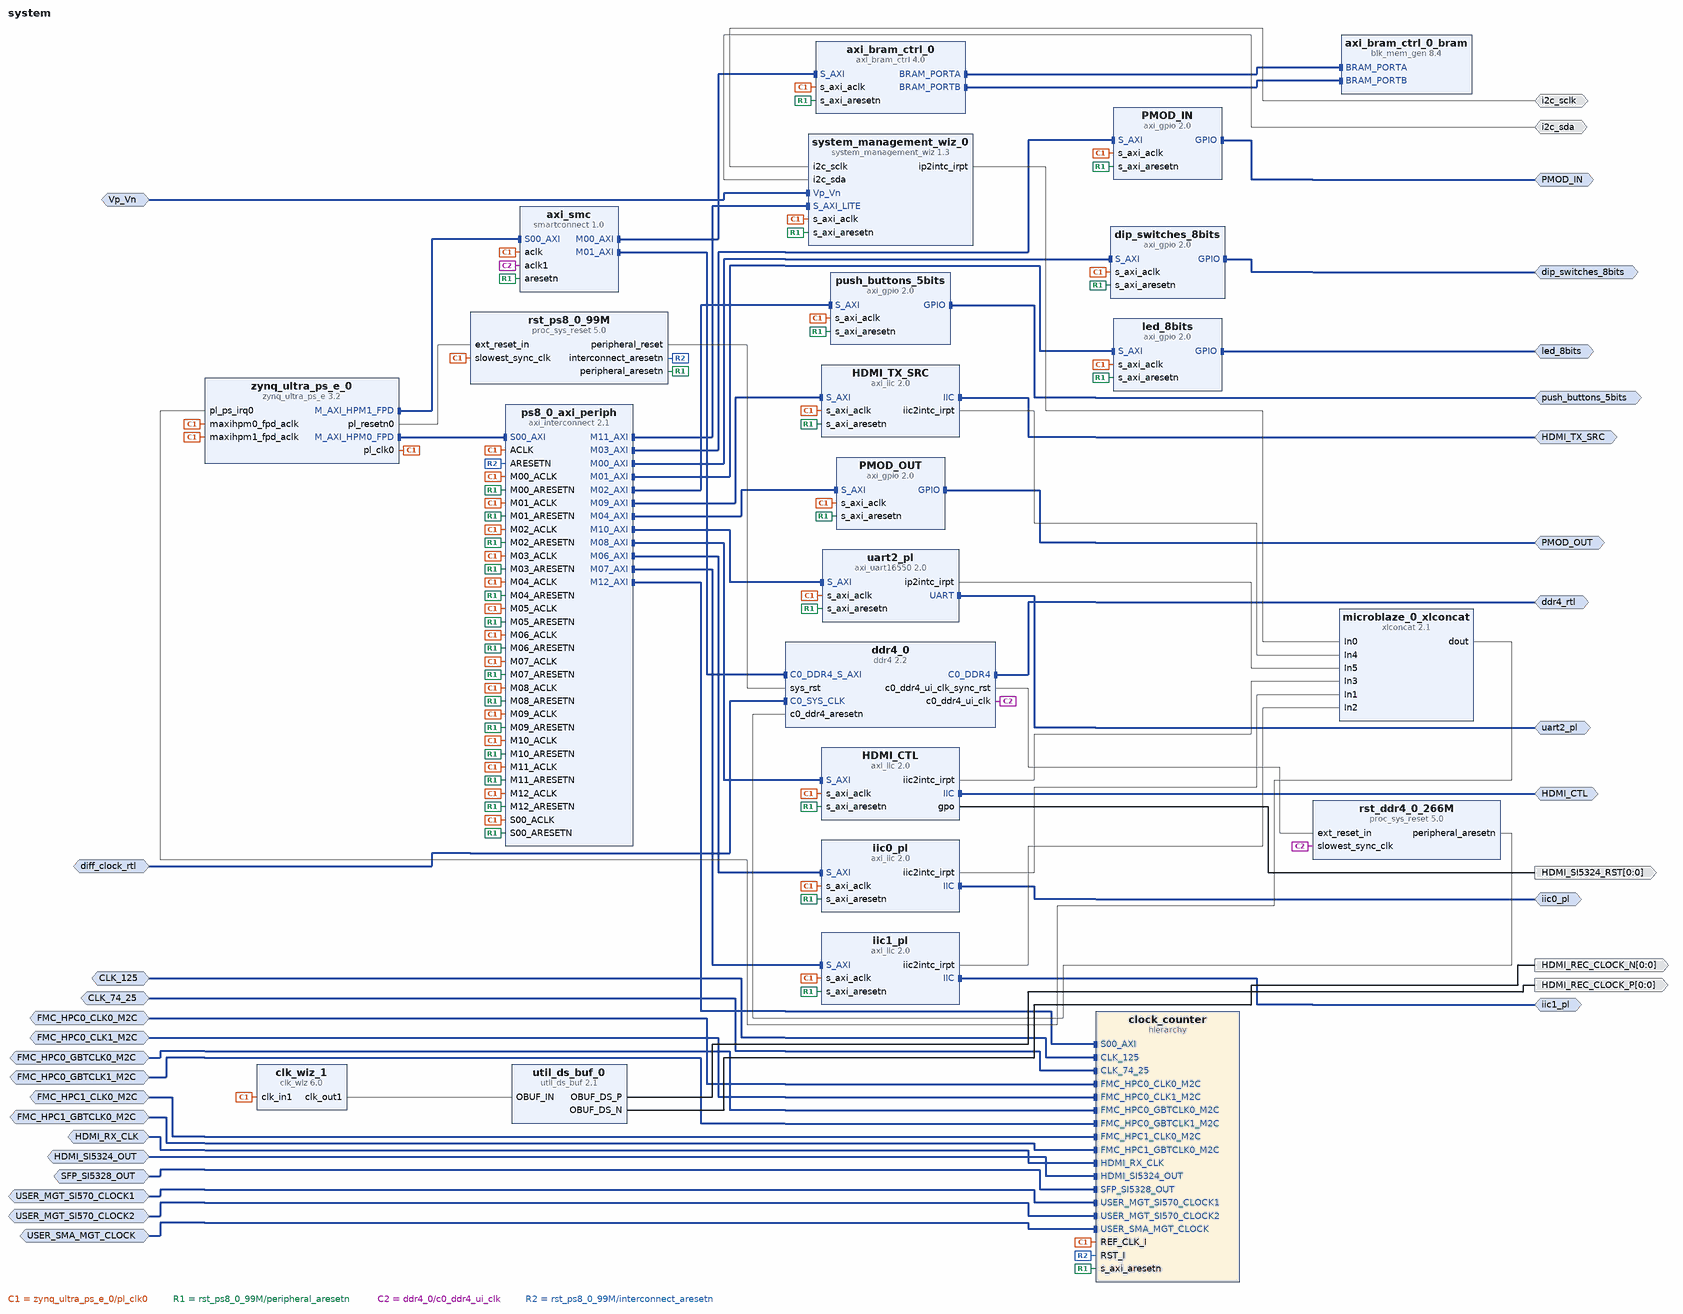
[diagram p0: block diagram of the top level]
# Vivado block design system, xczu7ev-ffvc1156-2-e, Vivado 2018.2
create_bd_design system

create_bd_intf_port -mode Master -vlnv xilinx.com:interface:iic_rtl:1.0 HDMI_CTL
create_bd_intf_port -mode Master -vlnv xilinx.com:interface:iic_rtl:1.0 HDMI_TX_SRC
create_bd_intf_port -mode Master -vlnv xilinx.com:interface:gpio_rtl:1.0 PMOD_IN
create_bd_intf_port -mode Master -vlnv xilinx.com:interface:gpio_rtl:1.0 PMOD_OUT
create_bd_intf_port -mode Slave -vlnv xilinx.com:interface:diff_analog_io_rtl:1.0 Vp_Vn
create_bd_intf_port -mode Master -vlnv xilinx.com:interface:ddr4_rtl:1.0 ddr4_rtl
create_bd_intf_port -mode Master -vlnv xilinx.com:interface:gpio_rtl:1.0 dip_switches_8bits
create_bd_intf_port -mode Master -vlnv xilinx.com:interface:iic_rtl:1.0 iic0_pl
create_bd_intf_port -mode Master -vlnv xilinx.com:interface:iic_rtl:1.0 iic1_pl
create_bd_intf_port -mode Master -vlnv xilinx.com:interface:gpio_rtl:1.0 led_8bits
create_bd_intf_port -mode Master -vlnv xilinx.com:interface:gpio_rtl:1.0 push_buttons_5bits
create_bd_intf_port -mode Master -vlnv xilinx.com:interface:uart_rtl:1.0 uart2_pl
create_bd_intf_port -mode Slave -vlnv xilinx.com:interface:diff_clock_rtl:1.0 CLK_125
create_bd_intf_port -mode Slave -vlnv xilinx.com:interface:diff_clock_rtl:1.0 CLK_74_25
create_bd_intf_port -mode Slave -vlnv xilinx.com:interface:diff_clock_rtl:1.0 FMC_HPC0_CLK0_M2C
create_bd_intf_port -mode Slave -vlnv xilinx.com:interface:diff_clock_rtl:1.0 FMC_HPC0_CLK1_M2C
create_bd_intf_port -mode Slave -vlnv xilinx.com:interface:diff_clock_rtl:1.0 FMC_HPC0_GBTCLK0_M2C
create_bd_intf_port -mode Slave -vlnv xilinx.com:interface:diff_clock_rtl:1.0 FMC_HPC0_GBTCLK1_M2C
create_bd_intf_port -mode Slave -vlnv xilinx.com:interface:diff_clock_rtl:1.0 FMC_HPC1_CLK0_M2C
create_bd_intf_port -mode Slave -vlnv xilinx.com:interface:diff_clock_rtl:1.0 FMC_HPC1_GBTCLK0_M2C
create_bd_intf_port -mode Slave -vlnv xilinx.com:interface:diff_clock_rtl:1.0 HDMI_RX_CLK
create_bd_intf_port -mode Slave -vlnv xilinx.com:interface:diff_clock_rtl:1.0 HDMI_SI5324_OUT
create_bd_intf_port -mode Slave -vlnv xilinx.com:interface:diff_clock_rtl:1.0 SFP_SI5328_OUT
create_bd_intf_port -mode Slave -vlnv xilinx.com:interface:diff_clock_rtl:1.0 USER_MGT_SI570_CLOCK1
create_bd_intf_port -mode Slave -vlnv xilinx.com:interface:diff_clock_rtl:1.0 USER_MGT_SI570_CLOCK2
create_bd_intf_port -mode Slave -vlnv xilinx.com:interface:diff_clock_rtl:1.0 USER_SMA_MGT_CLOCK
create_bd_intf_port -mode Slave -vlnv xilinx.com:interface:diff_clock_rtl:1.0 diff_clock_rtl
set_property -dict {CONFIG.FREQ_HZ 300000000} [get_bd_intf_ports diff_clock_rtl]
create_bd_port -dir IO i2c_sda
create_bd_port -dir IO i2c_sclk
create_bd_port -dir O -from 0 -to 0 HDMI_SI5324_RST
create_bd_port -dir O -from 0 -to 0 -type clk HDMI_REC_CLOCK_P
create_bd_port -dir O -from 0 -to 0 -type clk HDMI_REC_CLOCK_N

create_bd_cell -type hier clock_counter
create_bd_cell -type ip -vlnv xilinx.com:ip:blk_mem_gen:8.4 axi_bram_ctrl_0_bram
set_property -dict [list \
  CONFIG.Memory_Type True_Dual_Port_RAM \
  CONFIG.Enable_B Use_ENB_Pin \
  CONFIG.Use_RSTB_Pin true \
  CONFIG.Port_B_Clock 100 \
  CONFIG.Port_B_Write_Rate 50 \
  CONFIG.Port_B_Enable_Rate 100 \
  CONFIG.EN_SAFETY_CKT false \
] [get_bd_cells axi_bram_ctrl_0_bram]
create_bd_cell -type ip -vlnv xilinx.com:ip:xlconcat:2.1 microblaze_0_xlconcat
set_property -dict {CONFIG.NUM_PORTS 6 CONFIG.dout_width 6} [get_bd_cells microblaze_0_xlconcat]
create_bd_cell -type ip -vlnv xilinx.com:ip:axi_bram_ctrl:4.0 axi_bram_ctrl_0
set_property -dict {CONFIG.C_SELECT_XPM 0} [get_bd_cells axi_bram_ctrl_0]
create_bd_cell -type ip -vlnv xilinx.com:ip:axi_interconnect:2.1 ps8_0_axi_periph
set_property -dict {CONFIG.NUM_MI 13 CONFIG.SYNCHRONIZATION_STAGES 2} [get_bd_cells ps8_0_axi_periph]
create_bd_cell -type ip -vlnv xilinx.com:ip:system_management_wiz:1.3 system_management_wiz_0
set_property -dict [list \
  CONFIG.INTERFACE_SELECTION Enable_AXI \
  CONFIG.SERIAL_INTERFACE Enable_I2C \
  CONFIG.I2C_ADDRESS_OVERRIDE true \
  CONFIG.I2C_SLAVE_ADDRESS 32 \
  CONFIG.ENABLE_VCCPSINTLP_ALARM false \
  CONFIG.ENABLE_VCCPSAUX_ALARM false \
  CONFIG.ENABLE_VCCPSINTFP_ALARM false \
  CONFIG.ENABLE_EXTERNAL_MUX false \
  CONFIG.ENABLE_TEMP_BUS false \
  CONFIG.CHANNEL_ENABLE_VUSER0 true \
  CONFIG.CHANNEL_ENABLE_VUSER1 true \
  CONFIG.CHANNEL_ENABLE_VUSER2 true \
  CONFIG.CHANNEL_ENABLE_VUSER3 true \
  CONFIG.USER_SUPPLY0_BANK 64 \
  CONFIG.USER_SUPPLY1_BANK 65 \
  CONFIG.USER_SUPPLY2_BANK 67 \
  CONFIG.USER_SUPPLY3_BANK 68 \
  CONFIG.SELECT_USER_SUPPLY0 VCCINT \
  CONFIG.SELECT_USER_SUPPLY1 VCCO \
  CONFIG.SELECT_USER_SUPPLY2 VCCINT \
  CONFIG.SELECT_USER_SUPPLY3 VCCO \
  CONFIG.EXTERNAL_MUXADDR_ENABLE true \
] [get_bd_cells system_management_wiz_0]
create_bd_cell -type ip -vlnv xilinx.com:ip:zynq_ultra_ps_e:3.2 zynq_ultra_ps_e_0
set_property -dict [list \
  CONFIG.PSU__PSS_REF_CLK__FREQMHZ 33.330 \
  CONFIG.PSU__CAN1__PERIPHERAL__ENABLE 1 \
  CONFIG.PSU__CAN1__PERIPHERAL__IO {MIO 24 .. 25} \
  CONFIG.PSU__DPAUX__PERIPHERAL__ENABLE 1 \
  CONFIG.PSU__DPAUX__PERIPHERAL__IO {MIO 27 .. 30} \
  CONFIG.PSU__GEM__TSU__ENABLE 0 \
  CONFIG.PSU__FPGA_PL0_ENABLE 1 \
  CONFIG.PSU__ENET3__PERIPHERAL__ENABLE 1 \
  CONFIG.PSU__ENET3__FIFO__ENABLE 0 \
  CONFIG.PSU__ENET3__PTP__ENABLE 0 \
  CONFIG.PSU__ENET3__PERIPHERAL__IO {MIO 64 .. 75} \
  CONFIG.PSU__ENET3__GRP_MDIO__ENABLE 1 \
  CONFIG.PSU__ENET3__GRP_MDIO__IO {MIO 76 .. 77} \
  CONFIG.PSU__GPIO0_MIO__PERIPHERAL__ENABLE 1 \
  CONFIG.PSU__GPIO0_MIO__IO {MIO 0 .. 25} \
  CONFIG.PSU__GPIO1_MIO__PERIPHERAL__ENABLE 1 \
  CONFIG.PSU__GPIO1_MIO__IO {MIO 26 .. 51} \
  CONFIG.PSU__I2C0__PERIPHERAL__ENABLE 1 \
  CONFIG.PSU__I2C0__PERIPHERAL__IO {MIO 14 .. 15} \
  CONFIG.PSU__I2C1__PERIPHERAL__ENABLE 1 \
  CONFIG.PSU__I2C1__PERIPHERAL__IO {MIO 16 .. 17} \
  CONFIG.PSU__GT__LINK_SPEED HBR \
  CONFIG.PSU__GT__VLT_SWNG_LVL_4 0 \
  CONFIG.PSU__GT__PRE_EMPH_LVL_4 0 \
  CONFIG.PSU__USB0__REF_CLK_SEL {Ref Clk2} \
  CONFIG.PSU__USB0__REF_CLK_FREQ 26 \
  CONFIG.PSU__DP__REF_CLK_SEL {Ref Clk3} \
  CONFIG.PSU__DP__REF_CLK_FREQ 27 \
  CONFIG.PSU__SATA__REF_CLK_SEL {Ref Clk1} \
  CONFIG.PSU__SATA__REF_CLK_FREQ 125 \
  CONFIG.PSU__DP__LANE_SEL {Dual Lower} \
  CONFIG.SUBPRESET2 Custom \
  CONFIG.PSU__PMU__AIBACK__ENABLE 0 \
  CONFIG.PSU__PMU__PLERROR__ENABLE 0 \
  CONFIG.PSU__PMU__PERIPHERAL__ENABLE 1 \
  CONFIG.PSU__PMU__EMIO_GPI__ENABLE 0 \
  CONFIG.PSU__PMU__EMIO_GPO__ENABLE 0 \
  CONFIG.PSU__PMU__GPI0__ENABLE 0 \
  CONFIG.PSU__PMU__GPI1__ENABLE 0 \
  CONFIG.PSU__PMU__GPI2__ENABLE 0 \
  CONFIG.PSU__PMU__GPI3__ENABLE 0 \
  CONFIG.PSU__PMU__GPI4__ENABLE 0 \
  CONFIG.PSU__PMU__GPI5__ENABLE 0 \
  CONFIG.PSU__PMU__GPO0__ENABLE 0 \
  CONFIG.PSU__PMU__GPO1__ENABLE 0 \
  CONFIG.PSU__PMU__GPO2__ENABLE 0 \
  CONFIG.PSU__PMU__GPO3__ENABLE 0 \
  CONFIG.PSU__PMU__GPO4__ENABLE 0 \
  CONFIG.PSU__PMU__GPO5__ENABLE 0 \
  CONFIG.PSU__QSPI__PERIPHERAL__ENABLE 1 \
  CONFIG.PSU__QSPI__PERIPHERAL__IO {MIO 0 .. 12} \
  CONFIG.PSU__QSPI__PERIPHERAL__MODE {Dual Parallel} \
  CONFIG.PSU__QSPI__PERIPHERAL__DATA_MODE x4 \
  CONFIG.PSU__QSPI__GRP_FBCLK__ENABLE 1 \
  CONFIG.PSU__QSPI__GRP_FBCLK__IO {MIO 6} \
  CONFIG.PSU__SD1__PERIPHERAL__ENABLE 1 \
  CONFIG.PSU__SD1__PERIPHERAL__IO {MIO 39 .. 51} \
  CONFIG.PSU__SD1__GRP_CD__ENABLE 1 \
  CONFIG.PSU__SD1__GRP_CD__IO {MIO 45} \
  CONFIG.PSU__SD1__GRP_POW__ENABLE 1 \
  CONFIG.PSU__SD1__GRP_POW__IO {MIO 43} \
  CONFIG.PSU__SD1__GRP_WP__ENABLE 1 \
  CONFIG.PSU__SD1__GRP_WP__IO {MIO 44} \
  CONFIG.PSU__SD1__SLOT_TYPE {SD 3.0} \
  CONFIG.PSU__SD1__DATA_TRANSFER_MODE 8Bit \
  CONFIG.PSU__DEVICE_TYPE EV \
  CONFIG.PSU__SWDT0__PERIPHERAL__ENABLE 1 \
  CONFIG.PSU__SWDT0__CLOCK__ENABLE 0 \
  CONFIG.PSU__SWDT0__RESET__ENABLE 0 \
  CONFIG.PSU__SWDT1__PERIPHERAL__ENABLE 1 \
  CONFIG.PSU__SWDT1__CLOCK__ENABLE 0 \
  CONFIG.PSU__SWDT1__RESET__ENABLE 0 \
  CONFIG.PSU__UART0__BAUD_RATE 115200 \
  CONFIG.PSU__TTC0__PERIPHERAL__ENABLE 1 \
  CONFIG.PSU__TTC0__CLOCK__ENABLE 0 \
  CONFIG.PSU__TTC0__WAVEOUT__ENABLE 0 \
  CONFIG.PSU__TTC1__PERIPHERAL__ENABLE 1 \
  CONFIG.PSU__UART1__BAUD_RATE 115200 \
  CONFIG.PSU__TTC1__CLOCK__ENABLE 0 \
  CONFIG.PSU__TTC1__WAVEOUT__ENABLE 0 \
  CONFIG.PSU__TTC2__PERIPHERAL__ENABLE 1 \
  CONFIG.PSU__TTC2__CLOCK__ENABLE 0 \
  CONFIG.PSU__TTC2__WAVEOUT__ENABLE 0 \
  CONFIG.PSU__TTC3__PERIPHERAL__ENABLE 1 \
  CONFIG.PSU__TTC3__CLOCK__ENABLE 0 \
  CONFIG.PSU__TTC3__WAVEOUT__ENABLE 0 \
  CONFIG.PSU__CSUPMU__PERIPHERAL__VALID 1 \
  CONFIG.PSU__DDRC__BUS_WIDTH {64 Bit} \
  CONFIG.PSU__DDRC__DEVICE_CAPACITY {4096 MBits} \
  CONFIG.PSU__DDRC__DRAM_WIDTH {8 Bits} \
  CONFIG.PSU__DDRC__ECC Disabled \
  CONFIG.PSU__DDRC__MEMORY_TYPE {DDR 4} \
  CONFIG.PSU__DDRC__SPEED_BIN DDR4_2133P \
  CONFIG.PSU__DDRC__COMPONENTS UDIMM \
  CONFIG.PSU__UART0__PERIPHERAL__ENABLE 1 \
  CONFIG.PSU__UART0__PERIPHERAL__IO {MIO 18 .. 19} \
  CONFIG.PSU__UART0__MODEM__ENABLE 0 \
  CONFIG.PSU__UART1__PERIPHERAL__ENABLE 1 \
  CONFIG.PSU__UART1__PERIPHERAL__IO {MIO 20 .. 21} \
  CONFIG.PSU__UART1__MODEM__ENABLE 0 \
  CONFIG.PSU__USB0__PERIPHERAL__ENABLE 1 \
  CONFIG.PSU__USB0__PERIPHERAL__IO {MIO 52 .. 63} \
  CONFIG.PSU__USB3_0__PERIPHERAL__ENABLE 1 \
  CONFIG.PSU__USB3_0__PERIPHERAL__IO {GT Lane2} \
  CONFIG.PSU__USB3_0__EMIO__ENABLE 0 \
  CONFIG.PSU__USB2_0__EMIO__ENABLE 0 \
  CONFIG.PSU__USE__M_AXI_GP0 1 \
  CONFIG.PSU__MAXIGP0__DATA_WIDTH 128 \
  CONFIG.PSU__USE__M_AXI_GP1 1 \
  CONFIG.PSU__USE__M_AXI_GP2 0 \
  CONFIG.PSU__USE__IRQ0 1 \
  CONFIG.PSU__PRESET_APPLIED 1 \
  CONFIG.PSU__HIGH_ADDRESS__ENABLE 0 \
  CONFIG.PSU__DDR_HIGH_ADDRESS_GUI_ENABLE 1 \
  CONFIG.PSU_BANK_0_IO_STANDARD LVCMOS18 \
  CONFIG.PSU_BANK_1_IO_STANDARD LVCMOS18 \
  CONFIG.PSU_BANK_2_IO_STANDARD LVCMOS18 \
  CONFIG.PSU_BANK_3_IO_STANDARD LVCMOS33 \
  CONFIG.PSU__DISPLAYPORT__PERIPHERAL__ENABLE 1 \
  CONFIG.PSU__DISPLAYPORT__LANE0__ENABLE 1 \
  CONFIG.PSU__DISPLAYPORT__LANE0__IO {GT Lane1} \
  CONFIG.PSU__DISPLAYPORT__LANE1__ENABLE 1 \
  CONFIG.PSU__DISPLAYPORT__LANE1__IO {GT Lane0} \
  CONFIG.PSU__SATA__PERIPHERAL__ENABLE 1 \
  CONFIG.PSU__SATA__LANE1__IO {GT Lane3} \
  CONFIG.PSU__CRL_APB__USB3__ENABLE 1 \
  CONFIG.PSU__CRF_APB__APLL_CTRL__SRCSEL PSS_REF_CLK \
  CONFIG.PSU__CRF_APB__DPLL_CTRL__SRCSEL PSS_REF_CLK \
  CONFIG.PSU__CRF_APB__VPLL_CTRL__SRCSEL PSS_REF_CLK \
  CONFIG.PSU__CRF_APB__ACPU_CTRL__SRCSEL APLL \
  CONFIG.PSU__CRF_APB__DBG_TRACE_CTRL__SRCSEL IOPLL \
  CONFIG.PSU__CRF_APB__DBG_FPD_CTRL__SRCSEL IOPLL \
  CONFIG.PSU__CRF_APB__DP_VIDEO_REF_CTRL__SRCSEL VPLL \
  CONFIG.PSU__CRF_APB__DP_AUDIO_REF_CTRL__SRCSEL RPLL \
  CONFIG.PSU__CRF_APB__DP_STC_REF_CTRL__SRCSEL RPLL \
  CONFIG.PSU__CRF_APB__DDR_CTRL__SRCSEL DPLL \
  CONFIG.PSU__CRF_APB__GPU_REF_CTRL__SRCSEL IOPLL \
  CONFIG.PSU__CRL_APB__PL0_REF_CTRL__SRCSEL IOPLL \
  CONFIG.PSU__CRF_APB__GDMA_REF_CTRL__SRCSEL APLL \
  CONFIG.PSU__CRF_APB__DPDMA_REF_CTRL__SRCSEL APLL \
  CONFIG.PSU__CRF_APB__TOPSW_MAIN_CTRL__SRCSEL DPLL \
  CONFIG.PSU__CRF_APB__TOPSW_LSBUS_CTRL__SRCSEL IOPLL \
  CONFIG.PSU__CRF_APB__DBG_TSTMP_CTRL__SRCSEL IOPLL \
  CONFIG.PSU__CRL_APB__IOPLL_CTRL__SRCSEL PSS_REF_CLK \
  CONFIG.PSU__CRL_APB__RPLL_CTRL__SRCSEL PSS_REF_CLK \
  CONFIG.PSU__CRL_APB__GEM3_REF_CTRL__SRCSEL IOPLL \
  CONFIG.PSU__CRL_APB__USB0_BUS_REF_CTRL__SRCSEL IOPLL \
  CONFIG.PSU__CRL_APB__QSPI_REF_CTRL__SRCSEL IOPLL \
  CONFIG.PSU__CRL_APB__SDIO1_REF_CTRL__SRCSEL IOPLL \
  CONFIG.PSU__CRL_APB__UART0_REF_CTRL__SRCSEL IOPLL \
  CONFIG.PSU__CRL_APB__UART1_REF_CTRL__SRCSEL IOPLL \
  CONFIG.PSU__CRL_APB__I2C0_REF_CTRL__SRCSEL IOPLL \
  CONFIG.PSU__CRL_APB__I2C1_REF_CTRL__SRCSEL IOPLL \
  CONFIG.PSU__CRL_APB__CAN1_REF_CTRL__SRCSEL IOPLL \
  CONFIG.PSU__CRL_APB__CPU_R5_CTRL__SRCSEL IOPLL \
  CONFIG.PSU__CRL_APB__IOU_SWITCH_CTRL__SRCSEL IOPLL \
  CONFIG.PSU__CRL_APB__PCAP_CTRL__SRCSEL IOPLL \
  CONFIG.PSU__CRL_APB__LPD_LSBUS_CTRL__SRCSEL IOPLL \
  CONFIG.PSU__CRL_APB__LPD_SWITCH_CTRL__SRCSEL IOPLL \
  CONFIG.PSU__CRL_APB__DBG_LPD_CTRL__SRCSEL IOPLL \
  CONFIG.PSU__CRL_APB__ADMA_REF_CTRL__SRCSEL IOPLL \
  CONFIG.PSU__CRL_APB__TIMESTAMP_REF_CTRL__SRCSEL IOPLL \
  CONFIG.PSU__CRL_APB__USB3_DUAL_REF_CTRL__SRCSEL IOPLL \
  CONFIG.PSU__IOU_SLCR__IOU_TTC_APB_CLK__TTC0_SEL APB \
  CONFIG.PSU__IOU_SLCR__IOU_TTC_APB_CLK__TTC1_SEL APB \
  CONFIG.PSU__IOU_SLCR__IOU_TTC_APB_CLK__TTC2_SEL APB \
  CONFIG.PSU__IOU_SLCR__IOU_TTC_APB_CLK__TTC3_SEL APB \
  CONFIG.PSU__OVERRIDE__BASIC_CLOCK 0 \
  CONFIG.PSU__DLL__ISUSED 1 \
  CONFIG.PSU__DDR__INTERFACE__FREQMHZ 533.500 \
  CONFIG.PSU__CRF_APB__ACPU_CTRL__FREQMHZ 1200 \
  CONFIG.PSU__CRF_APB__DBG_TRACE_CTRL__FREQMHZ 250 \
  CONFIG.PSU__CRF_APB__DBG_FPD_CTRL__FREQMHZ 250 \
  CONFIG.PSU__CRF_APB__DDR_CTRL__FREQMHZ 1067 \
  CONFIG.PSU__CRF_APB__GPU_REF_CTRL__FREQMHZ 500 \
  CONFIG.PSU__CRL_APB__PL0_REF_CTRL__FREQMHZ 100 \
  CONFIG.PSU__CRF_APB__GDMA_REF_CTRL__FREQMHZ 600 \
  CONFIG.PSU__CRF_APB__DPDMA_REF_CTRL__FREQMHZ 600 \
  CONFIG.PSU__CRF_APB__TOPSW_MAIN_CTRL__FREQMHZ 533.33 \
  CONFIG.PSU__CRF_APB__TOPSW_LSBUS_CTRL__FREQMHZ 100 \
  CONFIG.PSU__CRF_APB__DBG_TSTMP_CTRL__FREQMHZ 250 \
  CONFIG.PSU__CRL_APB__GEM3_REF_CTRL__FREQMHZ 125 \
  CONFIG.PSU__CRL_APB__USB0_BUS_REF_CTRL__FREQMHZ 250 \
  CONFIG.PSU__CRL_APB__QSPI_REF_CTRL__FREQMHZ 125 \
  CONFIG.PSU__CRL_APB__SDIO1_REF_CTRL__FREQMHZ 200 \
  CONFIG.PSU__CRL_APB__UART0_REF_CTRL__FREQMHZ 100 \
  CONFIG.PSU__CRL_APB__UART1_REF_CTRL__FREQMHZ 100 \
  CONFIG.PSU__CRL_APB__I2C0_REF_CTRL__FREQMHZ 100 \
  CONFIG.PSU__CRL_APB__I2C1_REF_CTRL__FREQMHZ 100 \
  CONFIG.PSU__CRL_APB__CAN1_REF_CTRL__FREQMHZ 100 \
  CONFIG.PSU__CRL_APB__CPU_R5_CTRL__FREQMHZ 500 \
  CONFIG.PSU__CRL_APB__IOU_SWITCH_CTRL__FREQMHZ 250 \
  CONFIG.PSU__CRL_APB__PCAP_CTRL__FREQMHZ 200 \
  CONFIG.PSU__CRL_APB__LPD_LSBUS_CTRL__FREQMHZ 100 \
  CONFIG.PSU__CRL_APB__LPD_SWITCH_CTRL__FREQMHZ 500 \
  CONFIG.PSU__CRL_APB__DBG_LPD_CTRL__FREQMHZ 250 \
  CONFIG.PSU__CRL_APB__ADMA_REF_CTRL__FREQMHZ 500 \
  CONFIG.PSU__CRL_APB__TIMESTAMP_REF_CTRL__FREQMHZ 100 \
  CONFIG.PSU__CRL_APB__USB3_DUAL_REF_CTRL__FREQMHZ 20 \
  CONFIG.IIC0_BOARD_INTERFACE custom \
  CONFIG.IIC1_BOARD_INTERFACE custom \
  CONFIG.QSPI_BOARD_INTERFACE custom \
  CONFIG.NAND_BOARD_INTERFACE custom \
  CONFIG.SD0_BOARD_INTERFACE custom \
  CONFIG.SD1_BOARD_INTERFACE custom \
  CONFIG.CAN0_BOARD_INTERFACE custom \
  CONFIG.CAN1_BOARD_INTERFACE custom \
  CONFIG.PJTAG_BOARD_INTERFACE custom \
  CONFIG.PMU_BOARD_INTERFACE custom \
  CONFIG.CSU_BOARD_INTERFACE custom \
  CONFIG.SPI0_BOARD_INTERFACE custom \
  CONFIG.SPI1_BOARD_INTERFACE custom \
  CONFIG.UART0_BOARD_INTERFACE custom \
  CONFIG.UART1_BOARD_INTERFACE custom \
  CONFIG.GPIO_BOARD_INTERFACE custom \
  CONFIG.SWDT0_BOARD_INTERFACE custom \
  CONFIG.SWDT1_BOARD_INTERFACE custom \
  CONFIG.TRACE_BOARD_INTERFACE custom \
  CONFIG.TTC0_BOARD_INTERFACE custom \
  CONFIG.TTC1_BOARD_INTERFACE custom \
  CONFIG.TTC2_BOARD_INTERFACE custom \
  CONFIG.TTC3_BOARD_INTERFACE custom \
  CONFIG.GEM0_BOARD_INTERFACE custom \
  CONFIG.GEM1_BOARD_INTERFACE custom \
  CONFIG.GEM2_BOARD_INTERFACE custom \
  CONFIG.GEM3_BOARD_INTERFACE custom \
  CONFIG.USB0_BOARD_INTERFACE custom \
  CONFIG.USB1_BOARD_INTERFACE custom \
  CONFIG.PCIE_BOARD_INTERFACE custom \
  CONFIG.DP_BOARD_INTERFACE custom \
  CONFIG.SATA_BOARD_INTERFACE custom \
  CONFIG.PSU__PMU_COHERENCY 0 \
  CONFIG.PSU__USB0_COHERENCY 0 \
  CONFIG.PSU__SD1_COHERENCY 0 \
  CONFIG.PSU__QSPI_COHERENCY 0 \
  CONFIG.PSU__ENET3__TSU__ENABLE 0 \
  CONFIG.PSU__GEM3_COHERENCY 0 \
] [get_bd_cells zynq_ultra_ps_e_0]
# 724 more settings of zynq_ultra_ps_e_0 are not shown: defaults, MIO pin electricals, DDR timing, and values the tool derives
create_bd_cell -type ip -vlnv xilinx.com:ip:axi_iic:2.0 HDMI_CTL
set_property -dict [list \
  CONFIG.C_DEFAULT_VALUE 0xFF \
  CONFIG.C_SCL_INERTIAL_DELAY 5 \
  CONFIG.C_SDA_INERTIAL_DELAY 5 \
] [get_bd_cells HDMI_CTL]
create_bd_cell -type ip -vlnv xilinx.com:ip:axi_iic:2.0 HDMI_TX_SRC
set_property -dict [list \
  CONFIG.C_DEFAULT_VALUE 0xFF \
  CONFIG.C_SCL_INERTIAL_DELAY 5 \
  CONFIG.C_SDA_INERTIAL_DELAY 5 \
] [get_bd_cells HDMI_TX_SRC]
create_bd_cell -type ip -vlnv xilinx.com:ip:axi_gpio:2.0 PMOD_IN
set_property -dict {CONFIG.C_GPIO_WIDTH 8 CONFIG.C_ALL_INPUTS 1} [get_bd_cells PMOD_IN]
create_bd_cell -type ip -vlnv xilinx.com:ip:axi_gpio:2.0 PMOD_OUT
set_property -dict {CONFIG.C_GPIO_WIDTH 8 CONFIG.C_ALL_OUTPUTS 1} [get_bd_cells PMOD_OUT]
create_bd_cell -type ip -vlnv xilinx.com:ip:smartconnect:1.0 axi_smc
set_property -dict {CONFIG.NUM_MI 2 CONFIG.NUM_SI 1 CONFIG.NUM_CLKS 2} [get_bd_cells axi_smc]
create_bd_cell -type ip -vlnv xilinx.com:ip:clk_wiz:6.0 clk_wiz_1
set_property -dict [list \
  CONFIG.USE_PHASE_ALIGNMENT true \
  CONFIG.CLKIN1_JITTER_PS 100.01 \
  CONFIG.CLKOUT1_REQUESTED_OUT_FREQ 156.250 \
  CONFIG.CLKOUT1_DRIVES Buffer \
  CONFIG.FEEDBACK_SOURCE FDBK_AUTO \
  CONFIG.USE_LOCKED false \
  CONFIG.USE_RESET false \
  CONFIG.MMCM_DIVCLK_DIVIDE 5 \
  CONFIG.MMCM_CLKFBOUT_MULT_F 73.250 \
  CONFIG.MMCM_CLKIN1_PERIOD 10.001 \
  CONFIG.MMCM_CLKOUT0_DIVIDE_F 9.375 \
  CONFIG.CLKOUT1_JITTER 142.141 \
  CONFIG.CLKOUT1_PHASE_ERROR 262.668 \
] [get_bd_cells clk_wiz_1]
create_bd_cell -type ip -vlnv xilinx.com:ip:ddr4:2.2 ddr4_0
set_property -dict [list \
  CONFIG.RESET_BOARD_INTERFACE reset \
  CONFIG.C0_CLOCK_BOARD_INTERFACE user_si570_sysclk \
  CONFIG.C0_DDR4_BOARD_INTERFACE ddr4_sdram \
  CONFIG.C0.DDR4_AxiAddressWidth 31 \
  CONFIG.ADDN_UI_CLKOUT1_FREQ_HZ 100 \
  CONFIG.C0.BANK_GROUP_WIDTH 1 \
] [get_bd_cells ddr4_0]
create_bd_cell -type ip -vlnv xilinx.com:ip:axi_gpio:2.0 dip_switches_8bits
set_property -dict {CONFIG.USE_BOARD_FLOW true CONFIG.GPIO_BOARD_INTERFACE dip_switches_8bits} [get_bd_cells dip_switches_8bits]
create_bd_cell -type ip -vlnv xilinx.com:ip:axi_iic:2.0 iic0_pl
set_property -dict [list \
  CONFIG.C_DEFAULT_VALUE 0xFF \
  CONFIG.C_SCL_INERTIAL_DELAY 5 \
  CONFIG.C_SDA_INERTIAL_DELAY 5 \
  CONFIG.USE_BOARD_FLOW true \
  CONFIG.IIC_BOARD_INTERFACE iic0_pl \
] [get_bd_cells iic0_pl]
create_bd_cell -type ip -vlnv xilinx.com:ip:axi_iic:2.0 iic1_pl
set_property -dict [list \
  CONFIG.C_DEFAULT_VALUE 0xFF \
  CONFIG.C_SCL_INERTIAL_DELAY 5 \
  CONFIG.C_SDA_INERTIAL_DELAY 5 \
  CONFIG.USE_BOARD_FLOW true \
  CONFIG.IIC_BOARD_INTERFACE iic1_pl \
] [get_bd_cells iic1_pl]
create_bd_cell -type ip -vlnv xilinx.com:ip:axi_gpio:2.0 led_8bits
set_property -dict {CONFIG.USE_BOARD_FLOW true CONFIG.GPIO_BOARD_INTERFACE led_8bits} [get_bd_cells led_8bits]
create_bd_cell -type ip -vlnv xilinx.com:ip:axi_gpio:2.0 push_buttons_5bits
set_property -dict {CONFIG.USE_BOARD_FLOW true CONFIG.GPIO_BOARD_INTERFACE push_buttons_5bits} [get_bd_cells push_buttons_5bits]
create_bd_cell -type ip -vlnv xilinx.com:ip:proc_sys_reset:5.0 rst_ddr4_0_266M
create_bd_cell -type ip -vlnv xilinx.com:ip:proc_sys_reset:5.0 rst_ps8_0_99M
create_bd_cell -type ip -vlnv xilinx.com:ip:axi_uart16550:2.0 uart2_pl
set_property -dict [list \
  CONFIG.C_S_AXI_ACLK_FREQ_HZ 99990000 \
  CONFIG.USE_BOARD_FLOW true \
  CONFIG.UART_BOARD_INTERFACE uart2_pl \
] [get_bd_cells uart2_pl]
create_bd_cell -type ip -vlnv xilinx.com:ip:util_ds_buf:2.1 util_ds_buf_0
set_property -dict {CONFIG.C_BUF_TYPE OBUFDS} [get_bd_cells util_ds_buf_0]

# ---- hierarchy /clock_counter ----
current_bd_instance /clock_counter
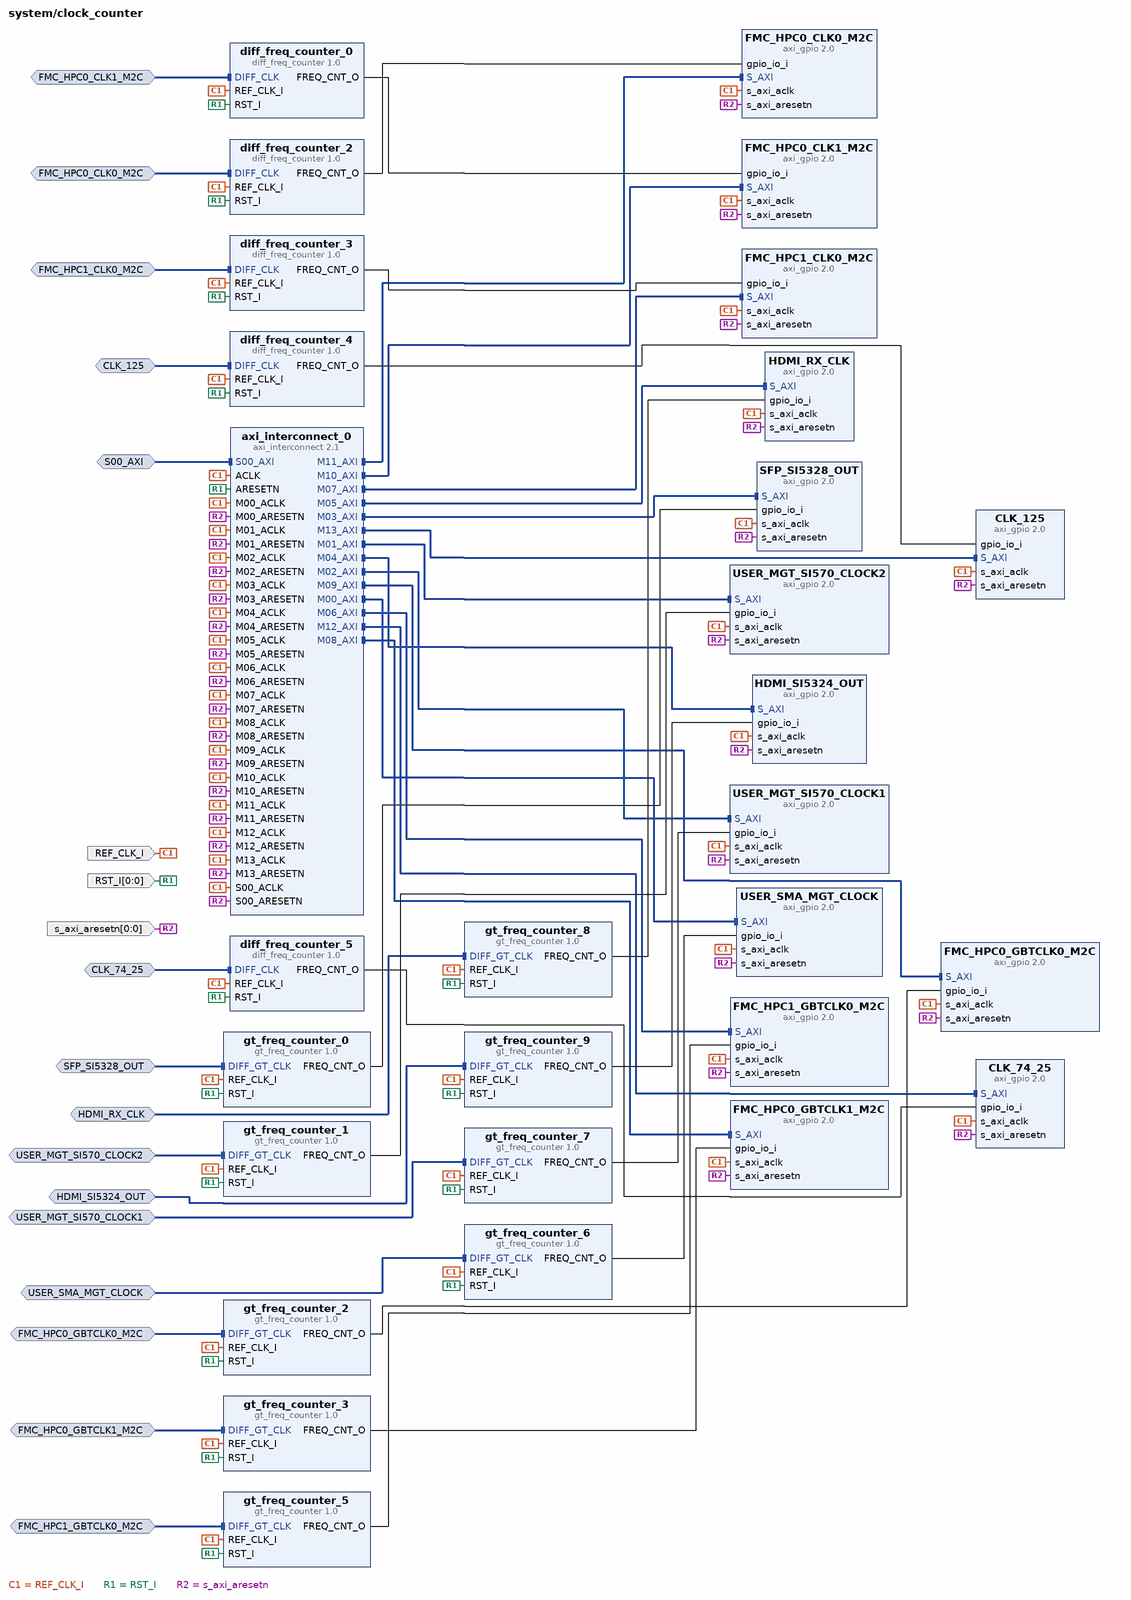
[diagram p1: block diagram inside /clock_counter]
create_bd_intf_pin -mode Slave -vlnv xilinx.com:interface:diff_clock_rtl:1.0 CLK_125
create_bd_intf_pin -mode Slave -vlnv xilinx.com:interface:diff_clock_rtl:1.0 CLK_74_25
create_bd_intf_pin -mode Slave -vlnv xilinx.com:interface:diff_clock_rtl:1.0 FMC_HPC0_CLK0_M2C
create_bd_intf_pin -mode Slave -vlnv xilinx.com:interface:diff_clock_rtl:1.0 FMC_HPC0_CLK1_M2C
create_bd_intf_pin -mode Slave -vlnv xilinx.com:interface:diff_clock_rtl:1.0 FMC_HPC0_GBTCLK0_M2C
create_bd_intf_pin -mode Slave -vlnv xilinx.com:interface:diff_clock_rtl:1.0 FMC_HPC0_GBTCLK1_M2C
create_bd_intf_pin -mode Slave -vlnv xilinx.com:interface:diff_clock_rtl:1.0 FMC_HPC1_CLK0_M2C
create_bd_intf_pin -mode Slave -vlnv xilinx.com:interface:diff_clock_rtl:1.0 FMC_HPC1_GBTCLK0_M2C
create_bd_intf_pin -mode Slave -vlnv xilinx.com:interface:diff_clock_rtl:1.0 HDMI_RX_CLK
create_bd_intf_pin -mode Slave -vlnv xilinx.com:interface:diff_clock_rtl:1.0 HDMI_SI5324_OUT
create_bd_intf_pin -mode Slave -vlnv xilinx.com:interface:diff_clock_rtl:1.0 SFP_SI5328_OUT
create_bd_intf_pin -mode Slave -vlnv xilinx.com:interface:diff_clock_rtl:1.0 USER_MGT_SI570_CLOCK1
create_bd_intf_pin -mode Slave -vlnv xilinx.com:interface:diff_clock_rtl:1.0 USER_MGT_SI570_CLOCK2
create_bd_intf_pin -mode Slave -vlnv xilinx.com:interface:diff_clock_rtl:1.0 USER_SMA_MGT_CLOCK
create_bd_intf_pin -mode Slave -vlnv xilinx.com:interface:aximm_rtl:1.0 S00_AXI
create_bd_pin -dir I -type clk REF_CLK_I
create_bd_pin -dir I -from 0 -to 0 -type rst RST_I
create_bd_pin -dir I -from 0 -to 0 -type rst s_axi_aresetn

create_bd_cell -type ip -vlnv xilinx.com:ip:diff_freq_counter:1.0 diff_freq_counter_0
create_bd_cell -type ip -vlnv xilinx.com:ip:diff_freq_counter:1.0 diff_freq_counter_2
create_bd_cell -type ip -vlnv xilinx.com:ip:diff_freq_counter:1.0 diff_freq_counter_3
create_bd_cell -type ip -vlnv xilinx.com:ip:diff_freq_counter:1.0 diff_freq_counter_4
create_bd_cell -type ip -vlnv xilinx.com:ip:diff_freq_counter:1.0 diff_freq_counter_5
create_bd_cell -type ip -vlnv xilinx.com:user:gt_freq_counter:1.0 gt_freq_counter_0
create_bd_cell -type ip -vlnv xilinx.com:user:gt_freq_counter:1.0 gt_freq_counter_1
create_bd_cell -type ip -vlnv xilinx.com:user:gt_freq_counter:1.0 gt_freq_counter_2
create_bd_cell -type ip -vlnv xilinx.com:user:gt_freq_counter:1.0 gt_freq_counter_3
create_bd_cell -type ip -vlnv xilinx.com:user:gt_freq_counter:1.0 gt_freq_counter_5
create_bd_cell -type ip -vlnv xilinx.com:user:gt_freq_counter:1.0 gt_freq_counter_6
create_bd_cell -type ip -vlnv xilinx.com:user:gt_freq_counter:1.0 gt_freq_counter_7
create_bd_cell -type ip -vlnv xilinx.com:user:gt_freq_counter:1.0 gt_freq_counter_8
create_bd_cell -type ip -vlnv xilinx.com:user:gt_freq_counter:1.0 gt_freq_counter_9
create_bd_cell -type ip -vlnv xilinx.com:ip:axi_interconnect:2.1 axi_interconnect_0
set_property -dict {CONFIG.NUM_MI 14 CONFIG.SYNCHRONIZATION_STAGES 2} [get_bd_cells axi_interconnect_0]
create_bd_cell -type ip -vlnv xilinx.com:ip:axi_gpio:2.0 CLK_125
set_property -dict {CONFIG.C_GPIO_WIDTH 16 CONFIG.C_ALL_INPUTS 1} [get_bd_cells CLK_125]
create_bd_cell -type ip -vlnv xilinx.com:ip:axi_gpio:2.0 CLK_74_25
set_property -dict {CONFIG.C_GPIO_WIDTH 16 CONFIG.C_ALL_INPUTS 1} [get_bd_cells CLK_74_25]
create_bd_cell -type ip -vlnv xilinx.com:ip:axi_gpio:2.0 FMC_HPC0_CLK0_M2C
set_property -dict {CONFIG.C_GPIO_WIDTH 16 CONFIG.C_ALL_INPUTS 1} [get_bd_cells FMC_HPC0_CLK0_M2C]
create_bd_cell -type ip -vlnv xilinx.com:ip:axi_gpio:2.0 FMC_HPC0_CLK1_M2C
set_property -dict {CONFIG.C_GPIO_WIDTH 16 CONFIG.C_ALL_INPUTS 1} [get_bd_cells FMC_HPC0_CLK1_M2C]
create_bd_cell -type ip -vlnv xilinx.com:ip:axi_gpio:2.0 FMC_HPC0_GBTCLK0_M2C
set_property -dict {CONFIG.C_GPIO_WIDTH 16 CONFIG.C_ALL_INPUTS 1} [get_bd_cells FMC_HPC0_GBTCLK0_M2C]
create_bd_cell -type ip -vlnv xilinx.com:ip:axi_gpio:2.0 FMC_HPC0_GBTCLK1_M2C
set_property -dict {CONFIG.C_GPIO_WIDTH 16 CONFIG.C_ALL_INPUTS 1} [get_bd_cells FMC_HPC0_GBTCLK1_M2C]
create_bd_cell -type ip -vlnv xilinx.com:ip:axi_gpio:2.0 FMC_HPC1_CLK0_M2C
set_property -dict {CONFIG.C_GPIO_WIDTH 16 CONFIG.C_ALL_INPUTS 1} [get_bd_cells FMC_HPC1_CLK0_M2C]
create_bd_cell -type ip -vlnv xilinx.com:ip:axi_gpio:2.0 FMC_HPC1_GBTCLK0_M2C
set_property -dict {CONFIG.C_GPIO_WIDTH 16 CONFIG.C_ALL_INPUTS 1} [get_bd_cells FMC_HPC1_GBTCLK0_M2C]
create_bd_cell -type ip -vlnv xilinx.com:ip:axi_gpio:2.0 HDMI_RX_CLK
set_property -dict {CONFIG.C_GPIO_WIDTH 16 CONFIG.C_ALL_INPUTS 1} [get_bd_cells HDMI_RX_CLK]
create_bd_cell -type ip -vlnv xilinx.com:ip:axi_gpio:2.0 HDMI_SI5324_OUT
set_property -dict {CONFIG.C_GPIO_WIDTH 16 CONFIG.C_ALL_INPUTS 1} [get_bd_cells HDMI_SI5324_OUT]
create_bd_cell -type ip -vlnv xilinx.com:ip:axi_gpio:2.0 SFP_SI5328_OUT
set_property -dict {CONFIG.C_GPIO_WIDTH 16 CONFIG.C_ALL_INPUTS 1} [get_bd_cells SFP_SI5328_OUT]
create_bd_cell -type ip -vlnv xilinx.com:ip:axi_gpio:2.0 USER_MGT_SI570_CLOCK1
set_property -dict {CONFIG.C_GPIO_WIDTH 16 CONFIG.C_ALL_INPUTS 1} [get_bd_cells USER_MGT_SI570_CLOCK1]
create_bd_cell -type ip -vlnv xilinx.com:ip:axi_gpio:2.0 USER_MGT_SI570_CLOCK2
set_property -dict {CONFIG.C_GPIO_WIDTH 16 CONFIG.C_ALL_INPUTS 1} [get_bd_cells USER_MGT_SI570_CLOCK2]
create_bd_cell -type ip -vlnv xilinx.com:ip:axi_gpio:2.0 USER_SMA_MGT_CLOCK
set_property -dict {CONFIG.C_GPIO_WIDTH 16 CONFIG.C_ALL_INPUTS 1} [get_bd_cells USER_SMA_MGT_CLOCK]

# ---- connections ----

current_bd_instance /clock_counter
connect_bd_intf_net [get_bd_intf_pins USER_MGT_SI570_CLOCK2/S_AXI] [get_bd_intf_pins axi_interconnect_0/M01_AXI]
connect_bd_intf_net [get_bd_intf_pins USER_SMA_MGT_CLOCK/S_AXI] [get_bd_intf_pins axi_interconnect_0/M00_AXI]
connect_bd_intf_net [get_bd_intf_pins USER_MGT_SI570_CLOCK1/S_AXI] [get_bd_intf_pins axi_interconnect_0/M02_AXI]
connect_bd_intf_net [get_bd_intf_pins SFP_SI5328_OUT/S_AXI] [get_bd_intf_pins axi_interconnect_0/M03_AXI]
connect_bd_intf_net [get_bd_intf_pins HDMI_SI5324_OUT/S_AXI] [get_bd_intf_pins axi_interconnect_0/M04_AXI]
connect_bd_intf_net [get_bd_intf_pins HDMI_RX_CLK/S_AXI] [get_bd_intf_pins axi_interconnect_0/M05_AXI]
connect_bd_intf_net [get_bd_intf_pins FMC_HPC1_GBTCLK0_M2C/S_AXI] [get_bd_intf_pins axi_interconnect_0/M06_AXI]
connect_bd_intf_net [get_bd_intf_pins FMC_HPC1_CLK0_M2C/S_AXI] [get_bd_intf_pins axi_interconnect_0/M07_AXI]
connect_bd_intf_net [get_bd_intf_pins FMC_HPC0_GBTCLK1_M2C/S_AXI] [get_bd_intf_pins axi_interconnect_0/M08_AXI]
connect_bd_intf_net [get_bd_intf_pins FMC_HPC0_GBTCLK0_M2C/S_AXI] [get_bd_intf_pins axi_interconnect_0/M09_AXI]
connect_bd_intf_net [get_bd_intf_pins FMC_HPC0_CLK1_M2C/S_AXI] [get_bd_intf_pins axi_interconnect_0/M10_AXI]
connect_bd_intf_net [get_bd_intf_pins FMC_HPC0_CLK0_M2C/S_AXI] [get_bd_intf_pins axi_interconnect_0/M11_AXI]
connect_bd_intf_net [get_bd_intf_pins CLK_74_25/S_AXI] [get_bd_intf_pins axi_interconnect_0/M12_AXI]
connect_bd_intf_net [get_bd_intf_pins CLK_125/S_AXI] [get_bd_intf_pins axi_interconnect_0/M13_AXI]
connect_bd_intf_net [get_bd_intf_pins CLK_125] [get_bd_intf_pins diff_freq_counter_4/DIFF_CLK]
connect_bd_intf_net [get_bd_intf_pins CLK_74_25] [get_bd_intf_pins diff_freq_counter_5/DIFF_CLK]
connect_bd_intf_net [get_bd_intf_pins FMC_HPC0_CLK0_M2C] [get_bd_intf_pins diff_freq_counter_2/DIFF_CLK]
connect_bd_intf_net [get_bd_intf_pins FMC_HPC0_CLK1_M2C] [get_bd_intf_pins diff_freq_counter_0/DIFF_CLK]
connect_bd_intf_net [get_bd_intf_pins FMC_HPC0_GBTCLK0_M2C] [get_bd_intf_pins gt_freq_counter_2/DIFF_GT_CLK]
connect_bd_intf_net [get_bd_intf_pins FMC_HPC0_GBTCLK1_M2C] [get_bd_intf_pins gt_freq_counter_3/DIFF_GT_CLK]
connect_bd_intf_net [get_bd_intf_pins FMC_HPC1_CLK0_M2C] [get_bd_intf_pins diff_freq_counter_3/DIFF_CLK]
connect_bd_intf_net [get_bd_intf_pins FMC_HPC1_GBTCLK0_M2C] [get_bd_intf_pins gt_freq_counter_5/DIFF_GT_CLK]
connect_bd_intf_net [get_bd_intf_pins HDMI_RX_CLK] [get_bd_intf_pins gt_freq_counter_8/DIFF_GT_CLK]
connect_bd_intf_net [get_bd_intf_pins HDMI_SI5324_OUT] [get_bd_intf_pins gt_freq_counter_9/DIFF_GT_CLK]
connect_bd_intf_net [get_bd_intf_pins SFP_SI5328_OUT] [get_bd_intf_pins gt_freq_counter_0/DIFF_GT_CLK]
connect_bd_intf_net [get_bd_intf_pins USER_MGT_SI570_CLOCK1] [get_bd_intf_pins gt_freq_counter_7/DIFF_GT_CLK]
connect_bd_intf_net [get_bd_intf_pins USER_MGT_SI570_CLOCK2] [get_bd_intf_pins gt_freq_counter_1/DIFF_GT_CLK]
connect_bd_intf_net [get_bd_intf_pins USER_SMA_MGT_CLOCK] [get_bd_intf_pins gt_freq_counter_6/DIFF_GT_CLK]
connect_bd_intf_net [get_bd_intf_pins S00_AXI] [get_bd_intf_pins axi_interconnect_0/S00_AXI]
connect_bd_net [get_bd_pins REF_CLK_I] \
  [get_bd_pins diff_freq_counter_0/REF_CLK_I] [get_bd_pins diff_freq_counter_2/REF_CLK_I] \
  [get_bd_pins diff_freq_counter_3/REF_CLK_I] [get_bd_pins diff_freq_counter_4/REF_CLK_I] \
  [get_bd_pins diff_freq_counter_5/REF_CLK_I] [get_bd_pins gt_freq_counter_0/REF_CLK_I] \
  [get_bd_pins gt_freq_counter_1/REF_CLK_I] [get_bd_pins gt_freq_counter_2/REF_CLK_I] \
  [get_bd_pins gt_freq_counter_3/REF_CLK_I] [get_bd_pins gt_freq_counter_5/REF_CLK_I] \
  [get_bd_pins gt_freq_counter_6/REF_CLK_I] [get_bd_pins gt_freq_counter_7/REF_CLK_I] \
  [get_bd_pins gt_freq_counter_8/REF_CLK_I] [get_bd_pins gt_freq_counter_9/REF_CLK_I] [get_bd_pins axi_interconnect_0/ACLK] \
  [get_bd_pins axi_interconnect_0/S00_ACLK] [get_bd_pins axi_interconnect_0/M00_ACLK] \
  [get_bd_pins axi_interconnect_0/M01_ACLK] [get_bd_pins axi_interconnect_0/M02_ACLK] \
  [get_bd_pins axi_interconnect_0/M03_ACLK] [get_bd_pins axi_interconnect_0/M04_ACLK] \
  [get_bd_pins axi_interconnect_0/M05_ACLK] [get_bd_pins axi_interconnect_0/M06_ACLK] \
  [get_bd_pins axi_interconnect_0/M07_ACLK] [get_bd_pins axi_interconnect_0/M08_ACLK] \
  [get_bd_pins axi_interconnect_0/M09_ACLK] [get_bd_pins axi_interconnect_0/M10_ACLK] \
  [get_bd_pins axi_interconnect_0/M11_ACLK] [get_bd_pins axi_interconnect_0/M12_ACLK] \
  [get_bd_pins axi_interconnect_0/M13_ACLK] [get_bd_pins CLK_125/s_axi_aclk] [get_bd_pins CLK_74_25/s_axi_aclk] \
  [get_bd_pins FMC_HPC0_CLK0_M2C/s_axi_aclk] [get_bd_pins FMC_HPC0_CLK1_M2C/s_axi_aclk] \
  [get_bd_pins FMC_HPC0_GBTCLK0_M2C/s_axi_aclk] [get_bd_pins FMC_HPC0_GBTCLK1_M2C/s_axi_aclk] \
  [get_bd_pins FMC_HPC1_CLK0_M2C/s_axi_aclk] [get_bd_pins FMC_HPC1_GBTCLK0_M2C/s_axi_aclk] \
  [get_bd_pins HDMI_RX_CLK/s_axi_aclk] [get_bd_pins HDMI_SI5324_OUT/s_axi_aclk] [get_bd_pins SFP_SI5328_OUT/s_axi_aclk] \
  [get_bd_pins USER_MGT_SI570_CLOCK1/s_axi_aclk] [get_bd_pins USER_MGT_SI570_CLOCK2/s_axi_aclk] \
  [get_bd_pins USER_SMA_MGT_CLOCK/s_axi_aclk]
connect_bd_net [get_bd_pins RST_I] \
  [get_bd_pins diff_freq_counter_0/RST_I] [get_bd_pins diff_freq_counter_2/RST_I] [get_bd_pins diff_freq_counter_3/RST_I] \
  [get_bd_pins diff_freq_counter_4/RST_I] [get_bd_pins diff_freq_counter_5/RST_I] [get_bd_pins gt_freq_counter_0/RST_I] \
  [get_bd_pins gt_freq_counter_1/RST_I] [get_bd_pins gt_freq_counter_2/RST_I] [get_bd_pins gt_freq_counter_3/RST_I] \
  [get_bd_pins gt_freq_counter_5/RST_I] [get_bd_pins gt_freq_counter_6/RST_I] [get_bd_pins gt_freq_counter_7/RST_I] \
  [get_bd_pins gt_freq_counter_8/RST_I] [get_bd_pins gt_freq_counter_9/RST_I] [get_bd_pins axi_interconnect_0/ARESETN]
connect_bd_net [get_bd_pins diff_freq_counter_0/FREQ_CNT_O] [get_bd_pins FMC_HPC0_CLK1_M2C/gpio_io_i]
connect_bd_net -net diff_freq_counter_0_FREQ_CNT_O5 [get_bd_pins diff_freq_counter_5/FREQ_CNT_O] [get_bd_pins CLK_74_25/gpio_io_i]
connect_bd_net [get_bd_pins diff_freq_counter_2/FREQ_CNT_O] [get_bd_pins FMC_HPC0_CLK0_M2C/gpio_io_i]
connect_bd_net [get_bd_pins diff_freq_counter_3/FREQ_CNT_O] [get_bd_pins FMC_HPC1_CLK0_M2C/gpio_io_i]
connect_bd_net [get_bd_pins diff_freq_counter_4/FREQ_CNT_O] [get_bd_pins CLK_125/gpio_io_i]
connect_bd_net [get_bd_pins gt_freq_counter_0/FREQ_CNT_O] [get_bd_pins SFP_SI5328_OUT/gpio_io_i]
connect_bd_net [get_bd_pins gt_freq_counter_1/FREQ_CNT_O] [get_bd_pins USER_MGT_SI570_CLOCK2/gpio_io_i]
connect_bd_net [get_bd_pins gt_freq_counter_2/FREQ_CNT_O] [get_bd_pins FMC_HPC0_GBTCLK0_M2C/gpio_io_i]
connect_bd_net [get_bd_pins gt_freq_counter_3/FREQ_CNT_O] [get_bd_pins FMC_HPC0_GBTCLK1_M2C/gpio_io_i]
connect_bd_net [get_bd_pins gt_freq_counter_5/FREQ_CNT_O] [get_bd_pins FMC_HPC1_GBTCLK0_M2C/gpio_io_i]
connect_bd_net [get_bd_pins gt_freq_counter_6/FREQ_CNT_O] [get_bd_pins USER_SMA_MGT_CLOCK/gpio_io_i]
connect_bd_net [get_bd_pins gt_freq_counter_7/FREQ_CNT_O] [get_bd_pins USER_MGT_SI570_CLOCK1/gpio_io_i]
connect_bd_net [get_bd_pins gt_freq_counter_8/FREQ_CNT_O] [get_bd_pins HDMI_RX_CLK/gpio_io_i]
connect_bd_net [get_bd_pins gt_freq_counter_9/FREQ_CNT_O] [get_bd_pins HDMI_SI5324_OUT/gpio_io_i]
connect_bd_net [get_bd_pins s_axi_aresetn] \
  [get_bd_pins axi_interconnect_0/S00_ARESETN] [get_bd_pins axi_interconnect_0/M00_ARESETN] \
  [get_bd_pins axi_interconnect_0/M01_ARESETN] [get_bd_pins axi_interconnect_0/M02_ARESETN] \
  [get_bd_pins axi_interconnect_0/M03_ARESETN] [get_bd_pins axi_interconnect_0/M04_ARESETN] \
  [get_bd_pins axi_interconnect_0/M05_ARESETN] [get_bd_pins axi_interconnect_0/M06_ARESETN] \
  [get_bd_pins axi_interconnect_0/M07_ARESETN] [get_bd_pins axi_interconnect_0/M08_ARESETN] \
  [get_bd_pins axi_interconnect_0/M09_ARESETN] [get_bd_pins axi_interconnect_0/M10_ARESETN] \
  [get_bd_pins axi_interconnect_0/M11_ARESETN] [get_bd_pins axi_interconnect_0/M12_ARESETN] \
  [get_bd_pins axi_interconnect_0/M13_ARESETN] [get_bd_pins CLK_125/s_axi_aresetn] [get_bd_pins CLK_74_25/s_axi_aresetn] \
  [get_bd_pins FMC_HPC0_CLK0_M2C/s_axi_aresetn] [get_bd_pins FMC_HPC0_CLK1_M2C/s_axi_aresetn] \
  [get_bd_pins FMC_HPC0_GBTCLK0_M2C/s_axi_aresetn] [get_bd_pins FMC_HPC0_GBTCLK1_M2C/s_axi_aresetn] \
  [get_bd_pins FMC_HPC1_CLK0_M2C/s_axi_aresetn] [get_bd_pins FMC_HPC1_GBTCLK0_M2C/s_axi_aresetn] \
  [get_bd_pins HDMI_RX_CLK/s_axi_aresetn] [get_bd_pins HDMI_SI5324_OUT/s_axi_aresetn] \
  [get_bd_pins SFP_SI5328_OUT/s_axi_aresetn] [get_bd_pins USER_MGT_SI570_CLOCK1/s_axi_aresetn] \
  [get_bd_pins USER_MGT_SI570_CLOCK2/s_axi_aresetn] [get_bd_pins USER_SMA_MGT_CLOCK/s_axi_aresetn]

current_bd_instance /
connect_bd_intf_net [get_bd_intf_pins axi_bram_ctrl_0/BRAM_PORTA] [get_bd_intf_pins axi_bram_ctrl_0_bram/BRAM_PORTA]
connect_bd_intf_net [get_bd_intf_pins axi_bram_ctrl_0/BRAM_PORTB] [get_bd_intf_pins axi_bram_ctrl_0_bram/BRAM_PORTB]
connect_bd_intf_net [get_bd_intf_pins axi_smc/M00_AXI] [get_bd_intf_pins axi_bram_ctrl_0/S_AXI]
connect_bd_intf_net [get_bd_intf_pins axi_smc/M01_AXI] [get_bd_intf_pins ddr4_0/C0_DDR4_S_AXI]
connect_bd_intf_net [get_bd_intf_pins dip_switches_8bits/S_AXI] [get_bd_intf_pins ps8_0_axi_periph/M00_AXI]
connect_bd_intf_net [get_bd_intf_pins led_8bits/S_AXI] [get_bd_intf_pins ps8_0_axi_periph/M01_AXI]
connect_bd_intf_net [get_bd_intf_pins push_buttons_5bits/S_AXI] [get_bd_intf_pins ps8_0_axi_periph/M02_AXI]
connect_bd_intf_net [get_bd_intf_pins PMOD_IN/S_AXI] [get_bd_intf_pins ps8_0_axi_periph/M03_AXI]
connect_bd_intf_net [get_bd_intf_pins PMOD_OUT/S_AXI] [get_bd_intf_pins ps8_0_axi_periph/M04_AXI]
connect_bd_intf_net [get_bd_intf_pins iic0_pl/S_AXI] [get_bd_intf_pins ps8_0_axi_periph/M06_AXI]
connect_bd_intf_net [get_bd_intf_pins iic1_pl/S_AXI] [get_bd_intf_pins ps8_0_axi_periph/M07_AXI]
connect_bd_intf_net [get_bd_intf_pins HDMI_CTL/S_AXI] [get_bd_intf_pins ps8_0_axi_periph/M08_AXI]
connect_bd_intf_net [get_bd_intf_pins HDMI_TX_SRC/S_AXI] [get_bd_intf_pins ps8_0_axi_periph/M09_AXI]
connect_bd_intf_net [get_bd_intf_pins uart2_pl/S_AXI] [get_bd_intf_pins ps8_0_axi_periph/M10_AXI]
connect_bd_intf_net [get_bd_intf_pins system_management_wiz_0/S_AXI_LITE] [get_bd_intf_pins ps8_0_axi_periph/M11_AXI]
connect_bd_intf_net [get_bd_intf_pins clock_counter/S00_AXI] [get_bd_intf_pins ps8_0_axi_periph/M12_AXI]
connect_bd_intf_net [get_bd_intf_pins zynq_ultra_ps_e_0/M_AXI_HPM0_FPD] [get_bd_intf_pins ps8_0_axi_periph/S00_AXI]
connect_bd_intf_net [get_bd_intf_pins axi_smc/S00_AXI] [get_bd_intf_pins zynq_ultra_ps_e_0/M_AXI_HPM1_FPD]
connect_bd_intf_net -intf_net axi_iic_2_IIC [get_bd_intf_ports HDMI_CTL] [get_bd_intf_pins HDMI_CTL/IIC]
connect_bd_intf_net -intf_net axi_iic_3_IIC [get_bd_intf_ports HDMI_TX_SRC] [get_bd_intf_pins HDMI_TX_SRC/IIC]
connect_bd_intf_net -intf_net GPIO_PMOD_IN_GPIO [get_bd_intf_ports PMOD_IN] [get_bd_intf_pins PMOD_IN/GPIO]
connect_bd_intf_net -intf_net GPIO_PMOD_OUT_GPIO [get_bd_intf_ports PMOD_OUT] [get_bd_intf_pins PMOD_OUT/GPIO]
connect_bd_intf_net [get_bd_intf_ports Vp_Vn] [get_bd_intf_pins system_management_wiz_0/Vp_Vn]
connect_bd_intf_net [get_bd_intf_ports ddr4_rtl] [get_bd_intf_pins ddr4_0/C0_DDR4]
connect_bd_intf_net -intf_net GPIO_DIP_GPIO [get_bd_intf_ports dip_switches_8bits] [get_bd_intf_pins dip_switches_8bits/GPIO]
connect_bd_intf_net -intf_net axi_iic_0_IIC [get_bd_intf_ports iic0_pl] [get_bd_intf_pins iic0_pl/IIC]
connect_bd_intf_net -intf_net axi_iic_1_IIC [get_bd_intf_ports iic1_pl] [get_bd_intf_pins iic1_pl/IIC]
connect_bd_intf_net -intf_net GPIO_LED_GPIO [get_bd_intf_ports led_8bits] [get_bd_intf_pins led_8bits/GPIO]
connect_bd_intf_net -intf_net GPIO_SW_GPIO [get_bd_intf_ports push_buttons_5bits] [get_bd_intf_pins push_buttons_5bits/GPIO]
connect_bd_intf_net -intf_net axi_uart16550_0_UART [get_bd_intf_ports uart2_pl] [get_bd_intf_pins uart2_pl/UART]
connect_bd_intf_net -intf_net DIFF_CLK_1_1 [get_bd_intf_ports CLK_125] [get_bd_intf_pins clock_counter/CLK_125]
connect_bd_intf_net -intf_net DIFF_CLK_1 [get_bd_intf_ports CLK_74_25] [get_bd_intf_pins clock_counter/CLK_74_25]
connect_bd_intf_net -intf_net DIFF_CLK_3_1 [get_bd_intf_ports FMC_HPC0_CLK0_M2C] [get_bd_intf_pins clock_counter/FMC_HPC0_CLK0_M2C]
connect_bd_intf_net -intf_net DIFF_CLK_5_1 [get_bd_intf_ports FMC_HPC0_CLK1_M2C] [get_bd_intf_pins clock_counter/FMC_HPC0_CLK1_M2C]
connect_bd_intf_net [get_bd_intf_ports FMC_HPC0_GBTCLK0_M2C] [get_bd_intf_pins clock_counter/FMC_HPC0_GBTCLK0_M2C]
connect_bd_intf_net -intf_net DIFF_GT_CLK_7 [get_bd_intf_ports FMC_HPC0_GBTCLK1_M2C] [get_bd_intf_pins clock_counter/FMC_HPC0_GBTCLK1_M2C]
connect_bd_intf_net -intf_net DIFF_CLK_2_1 [get_bd_intf_ports FMC_HPC1_CLK0_M2C] [get_bd_intf_pins clock_counter/FMC_HPC1_CLK0_M2C]
connect_bd_intf_net -intf_net DIFF_GT_CLK_5 [get_bd_intf_ports FMC_HPC1_GBTCLK0_M2C] [get_bd_intf_pins clock_counter/FMC_HPC1_GBTCLK0_M2C]
connect_bd_intf_net -intf_net DIFF_GT_CLK_2 [get_bd_intf_ports HDMI_RX_CLK] [get_bd_intf_pins clock_counter/HDMI_RX_CLK]
connect_bd_intf_net -intf_net DIFF_GT_CLK_1 [get_bd_intf_ports HDMI_SI5324_OUT] [get_bd_intf_pins clock_counter/HDMI_SI5324_OUT]
connect_bd_intf_net -intf_net DIFF_GT_CLK_10 [get_bd_intf_ports SFP_SI5328_OUT] [get_bd_intf_pins clock_counter/SFP_SI5328_OUT]
connect_bd_intf_net -intf_net DIFF_GT_CLK_2_1 [get_bd_intf_ports USER_MGT_SI570_CLOCK1] [get_bd_intf_pins clock_counter/USER_MGT_SI570_CLOCK1]
connect_bd_intf_net -intf_net USER_MGT_SI570_CLOCK2_1 [get_bd_intf_ports USER_MGT_SI570_CLOCK2] [get_bd_intf_pins clock_counter/USER_MGT_SI570_CLOCK2]
connect_bd_intf_net [get_bd_intf_ports USER_SMA_MGT_CLOCK] [get_bd_intf_pins clock_counter/USER_SMA_MGT_CLOCK]
connect_bd_intf_net [get_bd_intf_ports diff_clock_rtl] [get_bd_intf_pins ddr4_0/C0_SYS_CLK]
connect_bd_net [get_bd_pins HDMI_CTL/iic2intc_irpt] [get_bd_pins microblaze_0_xlconcat/In3]
connect_bd_net [get_bd_pins HDMI_TX_SRC/iic2intc_irpt] [get_bd_pins microblaze_0_xlconcat/In4]
connect_bd_net [get_bd_ports i2c_sda] [get_bd_pins system_management_wiz_0/i2c_sda]
connect_bd_net [get_bd_ports i2c_sclk] [get_bd_pins system_management_wiz_0/i2c_sclk]
connect_bd_net -net axi_uart16550_0_ip2intc_irpt [get_bd_pins uart2_pl/ip2intc_irpt] [get_bd_pins microblaze_0_xlconcat/In5]
connect_bd_net [get_bd_pins iic0_pl/iic2intc_irpt] [get_bd_pins microblaze_0_xlconcat/In1]
connect_bd_net [get_bd_pins iic1_pl/iic2intc_irpt] [get_bd_pins microblaze_0_xlconcat/In2]
connect_bd_net [get_bd_pins microblaze_0_xlconcat/dout] [get_bd_pins zynq_ultra_ps_e_0/pl_ps_irq0]
connect_bd_net [get_bd_pins zynq_ultra_ps_e_0/pl_clk0] \
  [get_bd_pins axi_bram_ctrl_0/s_axi_aclk] [get_bd_pins clock_counter/REF_CLK_I] [get_bd_pins ps8_0_axi_periph/ACLK] \
  [get_bd_pins ps8_0_axi_periph/S00_ACLK] [get_bd_pins ps8_0_axi_periph/M00_ACLK] [get_bd_pins ps8_0_axi_periph/M01_ACLK] \
  [get_bd_pins ps8_0_axi_periph/M02_ACLK] [get_bd_pins ps8_0_axi_periph/M03_ACLK] [get_bd_pins ps8_0_axi_periph/M04_ACLK] \
  [get_bd_pins ps8_0_axi_periph/M05_ACLK] [get_bd_pins ps8_0_axi_periph/M06_ACLK] [get_bd_pins ps8_0_axi_periph/M07_ACLK] \
  [get_bd_pins ps8_0_axi_periph/M08_ACLK] [get_bd_pins ps8_0_axi_periph/M09_ACLK] [get_bd_pins ps8_0_axi_periph/M10_ACLK] \
  [get_bd_pins ps8_0_axi_periph/M11_ACLK] [get_bd_pins ps8_0_axi_periph/M12_ACLK] \
  [get_bd_pins system_management_wiz_0/s_axi_aclk] [get_bd_pins zynq_ultra_ps_e_0/maxihpm0_fpd_aclk] \
  [get_bd_pins zynq_ultra_ps_e_0/maxihpm1_fpd_aclk] [get_bd_pins HDMI_CTL/s_axi_aclk] [get_bd_pins HDMI_TX_SRC/s_axi_aclk] \
  [get_bd_pins PMOD_IN/s_axi_aclk] [get_bd_pins PMOD_OUT/s_axi_aclk] [get_bd_pins axi_smc/aclk] \
  [get_bd_pins clk_wiz_1/clk_in1] [get_bd_pins dip_switches_8bits/s_axi_aclk] [get_bd_pins iic0_pl/s_axi_aclk] \
  [get_bd_pins iic1_pl/s_axi_aclk] [get_bd_pins led_8bits/s_axi_aclk] [get_bd_pins push_buttons_5bits/s_axi_aclk] \
  [get_bd_pins rst_ps8_0_99M/slowest_sync_clk] [get_bd_pins uart2_pl/s_axi_aclk]
connect_bd_net [get_bd_pins zynq_ultra_ps_e_0/pl_resetn0] [get_bd_pins rst_ps8_0_99M/ext_reset_in]
connect_bd_net [get_bd_pins rst_ps8_0_99M/peripheral_aresetn] \
  [get_bd_pins axi_bram_ctrl_0/s_axi_aresetn] [get_bd_pins clock_counter/s_axi_aresetn] \
  [get_bd_pins ps8_0_axi_periph/S00_ARESETN] [get_bd_pins ps8_0_axi_periph/M00_ARESETN] \
  [get_bd_pins ps8_0_axi_periph/M01_ARESETN] [get_bd_pins ps8_0_axi_periph/M02_ARESETN] \
  [get_bd_pins ps8_0_axi_periph/M03_ARESETN] [get_bd_pins ps8_0_axi_periph/M04_ARESETN] \
  [get_bd_pins ps8_0_axi_periph/M05_ARESETN] [get_bd_pins ps8_0_axi_periph/M06_ARESETN] \
  [get_bd_pins ps8_0_axi_periph/M07_ARESETN] [get_bd_pins ps8_0_axi_periph/M08_ARESETN] \
  [get_bd_pins ps8_0_axi_periph/M09_ARESETN] [get_bd_pins ps8_0_axi_periph/M10_ARESETN] \
  [get_bd_pins ps8_0_axi_periph/M11_ARESETN] [get_bd_pins ps8_0_axi_periph/M12_ARESETN] \
  [get_bd_pins system_management_wiz_0/s_axi_aresetn] [get_bd_pins HDMI_CTL/s_axi_aresetn] \
  [get_bd_pins HDMI_TX_SRC/s_axi_aresetn] [get_bd_pins PMOD_IN/s_axi_aresetn] [get_bd_pins PMOD_OUT/s_axi_aresetn] \
  [get_bd_pins axi_smc/aresetn] [get_bd_pins dip_switches_8bits/s_axi_aresetn] [get_bd_pins iic0_pl/s_axi_aresetn] \
  [get_bd_pins iic1_pl/s_axi_aresetn] [get_bd_pins led_8bits/s_axi_aresetn] [get_bd_pins push_buttons_5bits/s_axi_aresetn] \
  [get_bd_pins uart2_pl/s_axi_aresetn]
connect_bd_net [get_bd_pins ddr4_0/c0_ddr4_ui_clk] [get_bd_pins axi_smc/aclk1] [get_bd_pins rst_ddr4_0_266M/slowest_sync_clk]
connect_bd_net [get_bd_pins ddr4_0/c0_ddr4_ui_clk_sync_rst] [get_bd_pins rst_ddr4_0_266M/ext_reset_in]
connect_bd_net [get_bd_pins rst_ddr4_0_266M/peripheral_aresetn] [get_bd_pins ddr4_0/c0_ddr4_aresetn]
connect_bd_net [get_bd_pins rst_ps8_0_99M/interconnect_aresetn] [get_bd_pins clock_counter/RST_I] [get_bd_pins ps8_0_axi_periph/ARESETN]
connect_bd_net [get_bd_pins HDMI_CTL/gpo] [get_bd_ports HDMI_SI5324_RST]
connect_bd_net [get_bd_pins rst_ps8_0_99M/peripheral_reset] [get_bd_pins ddr4_0/sys_rst]
connect_bd_net [get_bd_pins system_management_wiz_0/ip2intc_irpt] [get_bd_pins microblaze_0_xlconcat/In0]
connect_bd_net [get_bd_pins clk_wiz_1/clk_out1] [get_bd_pins util_ds_buf_0/OBUF_IN]
connect_bd_net [get_bd_pins util_ds_buf_0/OBUF_DS_P] [get_bd_ports HDMI_REC_CLOCK_P]
connect_bd_net [get_bd_pins util_ds_buf_0/OBUF_DS_N] [get_bd_ports HDMI_REC_CLOCK_N]

# ---- address map ----
assign_bd_address -offset 0x000A0000000 -range 4K -target_address_space [get_bd_addr_spaces zynq_ultra_ps_e_0/Data] [get_bd_addr_segs HDMI_CTL/S_AXI/Reg]
assign_bd_address -offset 0x000A0001000 -range 4K -target_address_space [get_bd_addr_spaces zynq_ultra_ps_e_0/Data] [get_bd_addr_segs HDMI_TX_SRC/S_AXI/Reg]
assign_bd_address -offset 0x000A0002000 -range 4K -target_address_space [get_bd_addr_spaces zynq_ultra_ps_e_0/Data] [get_bd_addr_segs PMOD_IN/S_AXI/Reg]
assign_bd_address -offset 0x000A0003000 -range 4K -target_address_space [get_bd_addr_spaces zynq_ultra_ps_e_0/Data] [get_bd_addr_segs PMOD_OUT/S_AXI/Reg]
assign_bd_address -offset 0x000A0004000 -range 4K -target_address_space [get_bd_addr_spaces zynq_ultra_ps_e_0/Data] [get_bd_addr_segs clock_counter/CLK_125/S_AXI/Reg]
assign_bd_address -offset 0x000A0005000 -range 4K -target_address_space [get_bd_addr_spaces zynq_ultra_ps_e_0/Data] [get_bd_addr_segs clock_counter/CLK_74_25/S_AXI/Reg]
assign_bd_address -offset 0x000A0006000 -range 4K -target_address_space [get_bd_addr_spaces zynq_ultra_ps_e_0/Data] [get_bd_addr_segs clock_counter/FMC_HPC0_CLK0_M2C/S_AXI/Reg]
assign_bd_address -offset 0x000A0007000 -range 4K -target_address_space [get_bd_addr_spaces zynq_ultra_ps_e_0/Data] [get_bd_addr_segs clock_counter/FMC_HPC0_CLK1_M2C/S_AXI/Reg]
assign_bd_address -offset 0x000A0008000 -range 4K -target_address_space [get_bd_addr_spaces zynq_ultra_ps_e_0/Data] [get_bd_addr_segs clock_counter/FMC_HPC0_GBTCLK0_M2C/S_AXI/Reg]
assign_bd_address -offset 0x000A0009000 -range 4K -target_address_space [get_bd_addr_spaces zynq_ultra_ps_e_0/Data] [get_bd_addr_segs clock_counter/FMC_HPC0_GBTCLK1_M2C/S_AXI/Reg]
assign_bd_address -offset 0x000A000A000 -range 4K -target_address_space [get_bd_addr_spaces zynq_ultra_ps_e_0/Data] [get_bd_addr_segs clock_counter/FMC_HPC1_CLK0_M2C/S_AXI/Reg]
assign_bd_address -offset 0x000A000B000 -range 4K -target_address_space [get_bd_addr_spaces zynq_ultra_ps_e_0/Data] [get_bd_addr_segs clock_counter/FMC_HPC1_GBTCLK0_M2C/S_AXI/Reg]
assign_bd_address -offset 0x000A000C000 -range 4K -target_address_space [get_bd_addr_spaces zynq_ultra_ps_e_0/Data] [get_bd_addr_segs clock_counter/HDMI_RX_CLK/S_AXI/Reg]
assign_bd_address -offset 0x000A000D000 -range 4K -target_address_space [get_bd_addr_spaces zynq_ultra_ps_e_0/Data] [get_bd_addr_segs clock_counter/HDMI_SI5324_OUT/S_AXI/Reg]
assign_bd_address -offset 0x000A000E000 -range 4K -target_address_space [get_bd_addr_spaces zynq_ultra_ps_e_0/Data] [get_bd_addr_segs clock_counter/SFP_SI5328_OUT/S_AXI/Reg]
assign_bd_address -offset 0x000A000F000 -range 4K -target_address_space [get_bd_addr_spaces zynq_ultra_ps_e_0/Data] [get_bd_addr_segs clock_counter/USER_MGT_SI570_CLOCK1/S_AXI/Reg]
assign_bd_address -offset 0x000A0010000 -range 4K -target_address_space [get_bd_addr_spaces zynq_ultra_ps_e_0/Data] [get_bd_addr_segs clock_counter/USER_MGT_SI570_CLOCK2/S_AXI/Reg]
assign_bd_address -offset 0x000A0011000 -range 4K -target_address_space [get_bd_addr_spaces zynq_ultra_ps_e_0/Data] [get_bd_addr_segs clock_counter/USER_SMA_MGT_CLOCK/S_AXI/Reg]
assign_bd_address -offset 0x000A0012000 -range 4K -target_address_space [get_bd_addr_spaces zynq_ultra_ps_e_0/Data] [get_bd_addr_segs dip_switches_8bits/S_AXI/Reg]
assign_bd_address -offset 0x000A0013000 -range 4K -target_address_space [get_bd_addr_spaces zynq_ultra_ps_e_0/Data] [get_bd_addr_segs iic0_pl/S_AXI/Reg]
assign_bd_address -offset 0x000A0014000 -range 4K -target_address_space [get_bd_addr_spaces zynq_ultra_ps_e_0/Data] [get_bd_addr_segs iic1_pl/S_AXI/Reg]
assign_bd_address -offset 0x000A0015000 -range 4K -target_address_space [get_bd_addr_spaces zynq_ultra_ps_e_0/Data] [get_bd_addr_segs led_8bits/S_AXI/Reg]
assign_bd_address -offset 0x000A0016000 -range 4K -target_address_space [get_bd_addr_spaces zynq_ultra_ps_e_0/Data] [get_bd_addr_segs push_buttons_5bits/S_AXI/Reg]
assign_bd_address -offset 0x000A0018000 -range 8K -target_address_space [get_bd_addr_spaces zynq_ultra_ps_e_0/Data] [get_bd_addr_segs system_management_wiz_0/S_AXI_LITE/Reg]
assign_bd_address -offset 0x000A001A000 -range 8K -target_address_space [get_bd_addr_spaces zynq_ultra_ps_e_0/Data] [get_bd_addr_segs uart2_pl/S_AXI/Reg]
assign_bd_address -offset 0x000B0000000 -range 128K -target_address_space [get_bd_addr_spaces zynq_ultra_ps_e_0/Data] [get_bd_addr_segs axi_bram_ctrl_0/S_AXI/Mem0]
assign_bd_address -offset 0x00500000000 -range 2G -target_address_space [get_bd_addr_spaces zynq_ultra_ps_e_0/Data] [get_bd_addr_segs ddr4_0/C0_DDR4_MEMORY_MAP/C0_DDR4_ADDRESS_BLOCK]

validate_bd_design
save_bd_design
